# EAGLE design OpenAg_Signals_V6 (EAGLE 6.6.0)
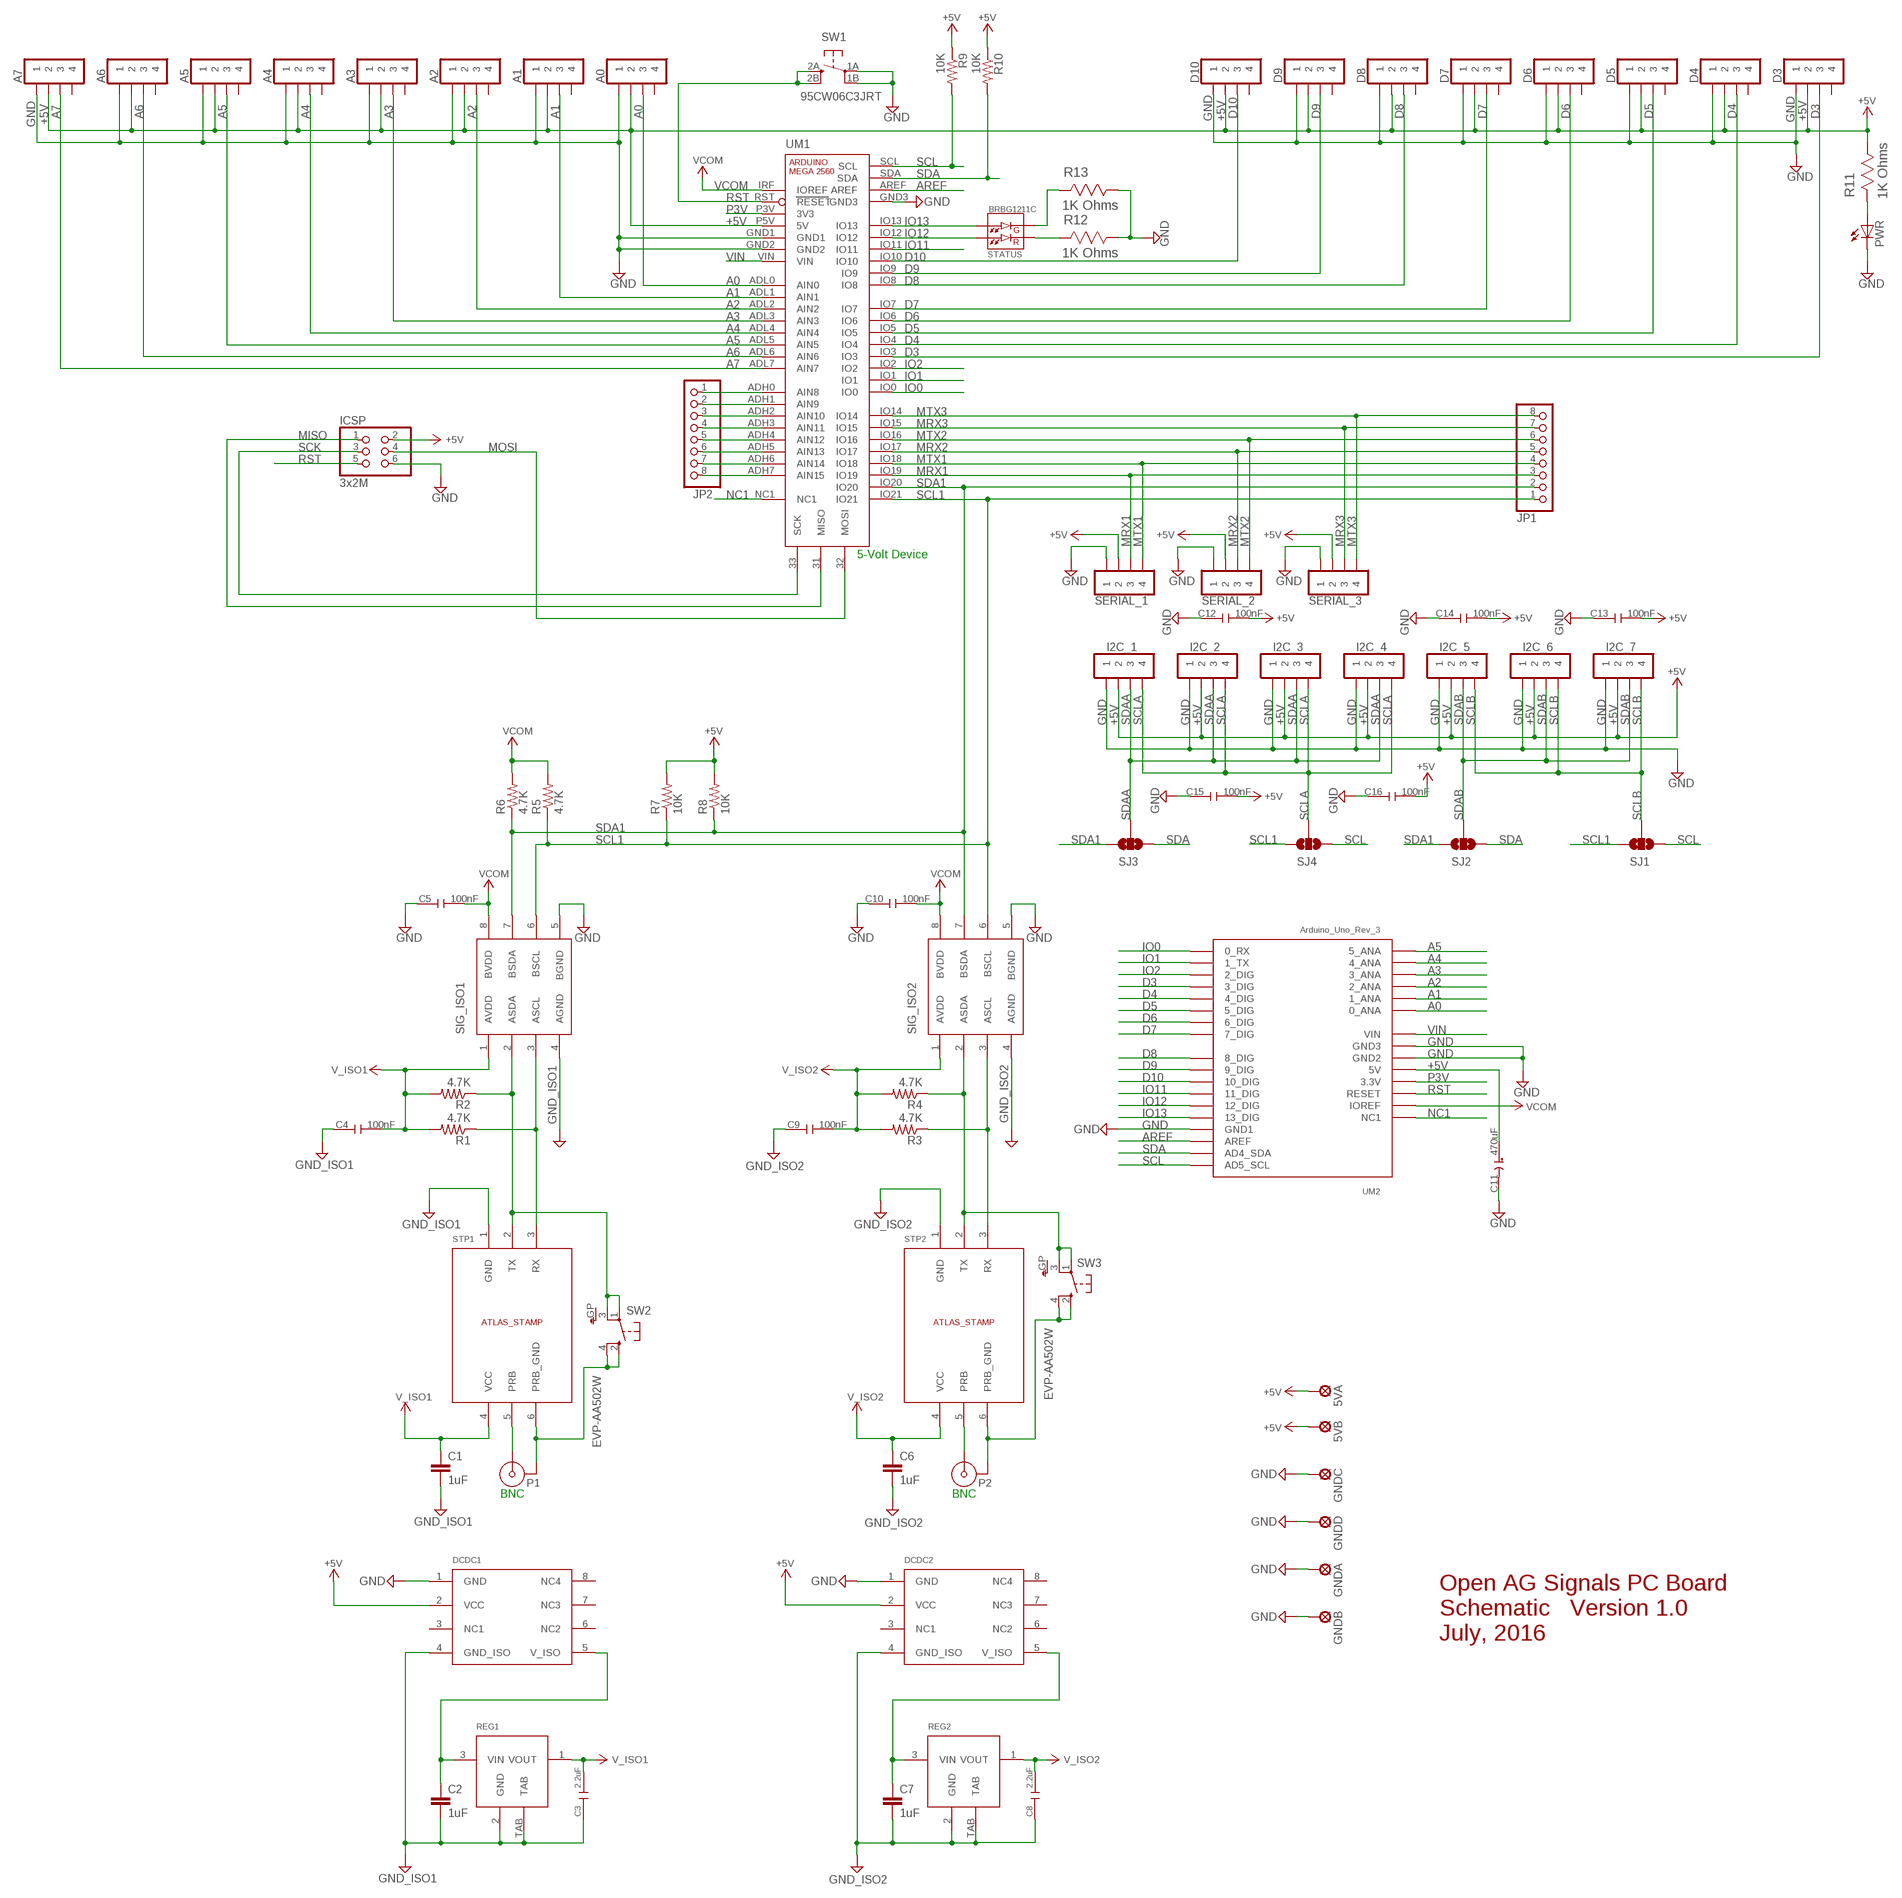
[diagram p0: schematic, sheet 1]

## Parts
5VA  PAD070  [PAD070]
5VB  PAD070  [PAD070]
A0  MOLEX_0705430003  [MOLEX_0705430003]
A1  MOLEX_0705430003  [MOLEX_0705430003]
A2  MOLEX_0705430003  [MOLEX_0705430003]
A3  MOLEX_0705430003  [MOLEX_0705430003]
A4  MOLEX_0705430003  [MOLEX_0705430003]
A5  MOLEX_0705430003  [MOLEX_0705430003]
A6  MOLEX_0705430003  [MOLEX_0705430003]
A7  MOLEX_0705430003  [MOLEX_0705430003]
C1  1uF  1UF-25V-10%(0805)  [0805]
C2  1uF  1UF-25V-10%(0805)  [0805]
C3  2.2uF  CGA4J1X7R1V225K125AC  [M0805]
C4  C-N-100.0N-X7R-25V-10P-0805  [M0805]
C5  C-N-100.0N-X7R-25V-10P-0805  [M0805]
C6  1uF  1UF-25V-10%(0805)  [0805]
C7  1uF  1UF-25V-10%(0805)  [0805]
C8  2.2uF  CGA4J1X7R1V225K125AC  [M0805]
C9  C-N-100.0N-X7R-25V-10P-0805  [M0805]
C10  C-N-100.0N-X7R-25V-10P-0805  [M0805]
C11  T495X477K010ATE100  [M2917]
C12  C-N-100.0N-X7R-25V-10P-0805  [M0805]
C13  C-N-100.0N-X7R-25V-10P-0805  [M0805]
C14  C-N-100.0N-X7R-25V-10P-0805  [M0805]
C15  C-N-100.0N-X7R-25V-10P-0805  [M0805]
C16  C-N-100.0N-X7R-25V-10P-0805  [M0805]
D3  MOLEX_0705430003  [MOLEX_0705430003]
D4  MOLEX_0705430003  [MOLEX_0705430003]
D5  MOLEX_0705430003  [MOLEX_0705430003]
D6  MOLEX_0705430003  [MOLEX_0705430003]
D7  MOLEX_0705430003  [MOLEX_0705430003]
D8  MOLEX_0705430003  [MOLEX_0705430003]
D9  MOLEX_0705430003  [MOLEX_0705430003]
D10  MOLEX_0705430003  [MOLEX_0705430003]
DCDC1  RECOM_R1SE_0505_R  [RECOM_R1SE_0505_R]
DCDC2  RECOM_R1SE_0505_R  [RECOM_R1SE_0505_R]
GNDA  PAD070  [PAD070]
GNDB  PAD070  [PAD070]
GNDC  PAD070  [PAD070]
GNDD  PAD070  [PAD070]
I2C_1  MOLEX_0705430003  [MOLEX_0705430003]
I2C_2  MOLEX_0705430003  [MOLEX_0705430003]
I2C_3  MOLEX_0705430003  [MOLEX_0705430003]
I2C_4  MOLEX_0705430003  [MOLEX_0705430003]
I2C_5  MOLEX_0705430003  [MOLEX_0705430003]
I2C_6  MOLEX_0705430003  [MOLEX_0705430003]
I2C_7  MOLEX_0705430003  [MOLEX_0705430003]
ICSP  3x2M  PINHD-2X3  [2X03]
JP1  PINHD-1X8BIG  [1X08-BIG]
JP2  PINHD-1X8BIG  [1X08-BIG]
P1  BNC_TE_1_1337542_0  [BNC_FEMALE_PANEL_RGT_ANGLE_MNT]
P2  BNC_TE_1_1337542_0  [BNC_FEMALE_PANEL_RGT_ANGLE_MNT]
PWR  LED_LEDCHIPLED_0805  [LED_CHIPLED_0805]
R1  4.7K  RESISTOR  [0805]
R2  4.7K  RESISTOR  [0805]
R3  4.7K  RESISTOR  [0805]
R4  4.7K  RESISTOR  [0805]
R5  4.7K  RESISTOR  [0805]
R6  4.7K  RESISTOR  [0805]
R7  10K  10KOHM1/10W1%(0603)0603  [0603-RES]
R8  10K  10KOHM1/10W1%(0603)0603  [0603-RES]
R9  10K  10KOHM1/10W1%(0603)0603  [0603-RES]
R10  10K  10KOHM1/10W1%(0603)0603  [0603-RES]
R11  1K Ohms  CPF0603F1K1C1  [RESC1608X60N]
R12  1K Ohms  CPF0603F1K1C1  [RESC1608X60N]
R13  1K Ohms  CPF0603F1K1C1  [RESC1608X60N]
REG1  LD2981ABU50TR  [SOT89]
REG2  LD2981ABU50TR  [SOT89]
SERIAL_1  MOLEX_0705430003  [MOLEX_0705430003]
SERIAL_2  MOLEX_0705430003  [MOLEX_0705430003]
SERIAL_3  MOLEX_0705430003  [MOLEX_0705430003]
SIG_ISO1  SI8600AC-B-IS  [SO8ISO]
SIG_ISO2  SI8600AC-B-IS  [SO8ISO]
SJ1  SOLDERJUMPER_2WAYT  [SJ_2]
SJ2  SOLDERJUMPER_2WAYT  [SJ_2]
SJ3  SOLDERJUMPER_2WAYT  [SJ_2]
SJ4  SOLDERJUMPER_2WAYT  [SJ_2]
STATUS  LED-REDGRN-BRBG1211C  [BILED-0605]
STP1  ATLAS_SCIENTIFIC_STAMP  [ATLAS_SCIENTIFIC_STAMP]
STP2  ATLAS_SCIENTIFIC_STAMP  [ATLAS_SCIENTIFIC_STAMP]
SW1  95CW06C3JRT  [GRAYHILL_95CW06C3JRT]
SW2  EVP-AA502W  [PANASONIC-EVP-AA502W]
SW3  EVP-AA502W  [PANASONIC-EVP-AA502W]
UM1  ARDUINO_MEGA_2560_R3_SIDES  [ARDUINO_MEGA_2560_R3_CONNECTORS]
UM2  ARDUINO_UNO_REV3_SOCKET  [ARDUINO_UNO_REV3_SOCKET]

## Nets
+5V: 5VA.1(MP) 5VB.1(MP) A0.2 A1.2 A2.2 A3.2 A4.2 A5.2 A6.2 A7.2 C11.P C12.2 C13.2 C14.2 C15.2 C16.2 D3.2 D4.2 D5.2 D6.2 D7.2 D8.2 D9.2 D10.2 DCDC1.2(VCC) DCDC2.2(VCC) I2C_1.2 I2C_2.2 I2C_3.2 I2C_4.2 I2C_5.2 I2C_6.2 I2C_7.2 ICSP.2 R7.2 R8.2 R9.1 R10.1 R11.1 SERIAL_1.2 SERIAL_2.2 SERIAL_3.2 UM1.P5V(5V) UM2.PWR_5V(5V)
A0: A0.3 UM1.ADL0(AIN0) UM2.AD0(0_ANA)
A1: A1.3 UM1.ADL1(AIN1) UM2.AD1(1_ANA)
A2: A2.3 UM1.ADL2(AIN2) UM2.AD2(2_ANA)
A3: A3.3 UM1.ADL3(AIN3) UM2.AD3(3_ANA)
A4: A4.3 UM1.ADL4(AIN4) UM2.AD4(4_ANA)
A5: A5.3 UM1.ADL5(AIN5) UM2.AD5(5_ANA)
A6: A6.3 UM1.ADL6(AIN6)
A7: A7.3 UM1.ADL7(AIN7)
AREF: UM1.AREF UM2.IOH15(AREF)
D3: D3.3 UM1.IO3 UM2.IOL3(3_DIG)
D4: D4.3 UM1.IO4 UM2.IOL4(4_DIG)
D5: D5.3 UM1.IO5 UM2.IOL5(5_DIG)
D6: D6.3 UM1.IO6 UM2.IOL6(6_DIG)
D7: D7.3 UM1.IO7 UM2.IOL7(7_DIG)
D8: D8.3 UM1.IO8 UM2.IOH8(8_DIG)
D9: D9.3 UM1.IO9 UM2.IOH9(9_DIG)
D10: D10.3 UM1.IO10 UM2.IOH10(10_DIG)
GND: A0.1 A1.1 A2.1 A3.1 A4.1 A5.1 A6.1 A7.1 C5.1 C10.1 C11.N C12.1 C13.1 C14.1 C15.1 C16.1 D3.1 D4.1 D5.1 D6.1 D7.1 D8.1 D9.1 D10.1 DCDC1.1(GND) DCDC2.1(GND) GNDA.1(MP) GNDB.1(MP) GNDC.1(MP) GNDD.1(MP) I2C_1.1 I2C_2.1 I2C_3.1 I2C_4.1 I2C_5.1 I2C_6.1 I2C_7.1 ICSP.6 PWR.C R12.1 R13.1 SERIAL_1.1 SERIAL_2.1 SERIAL_3.1 SIG_ISO1.5(BGND) SIG_ISO2.5(BGND) SW1.1A(PA1) SW1.1B(PA2) UM1.GND1 UM1.GND2 UM1.GND3 UM2.IOH14(GND1) UM2.PWR_GND2(GND2) UM2.PWR_GND3(GND3)
GND_ISO1: C1.2 C2.2 C3.1 C4.1 DCDC1.4(GND_ISO) REG1.2(GND) REG1.TAB SIG_ISO1.4(AGND) STP1.1(GND)
GND_ISO2: C6.2 C7.2 C8.1 C9.1 DCDC2.4(GND_ISO) REG2.2(GND) REG2.TAB SIG_ISO2.4(AGND) STP2.1(GND)
IO0: UM1.IO0 UM2.IOL0(0_RX)
IO1: UM1.IO1 UM2.IOL1(1_TX)
IO2: UM1.IO2 UM2.IOL2(2_DIG)
IO11: UM1.IO11 UM2.IOH11(11_DIG)
IO12: STATUS.1(RA) UM1.IO12 UM2.IOH12(12_DIG)
IO13: STATUS.3(GA) UM1.IO13 UM2.IOH13(13_DIG)
MISO: ICSP.1 UM1.31(MISO)
MOSI: ICSP.4 UM1.32(MOSI)
MRX1: JP1.3 SERIAL_1.3 UM1.IO19
MRX2: JP1.5 SERIAL_2.3 UM1.IO17
MRX3: JP1.7 SERIAL_3.3 UM1.IO15
MTX1: JP1.4 SERIAL_1.4 UM1.IO18
MTX2: JP1.6 SERIAL_2.4 UM1.IO16
MTX3: JP1.8 SERIAL_3.4 UM1.IO14
N$1: P1.1(P) STP1.5(PRB)
N$2: R12.2 STATUS.2(RC)
N$3: PWR.A R11.2
N$4: R1.1 SIG_ISO1.3(ASCL) STP1.3(RX)
N$5: R2.1 SIG_ISO1.2(ASDA) STP1.2(TX) SW2.1 SW2.3
N$6: P1.2(G1) STP1.6(PRB_GND) SW2.2 SW2.4
N$7: P2.1(P) STP2.5(PRB)
N$8: R13.2 STATUS.4(GC)
N$9: R3.1 SIG_ISO2.3(ASCL) STP2.3(RX)
N$10: P2.2(G1) STP2.6(PRB_GND) SW3.2 SW3.4
N$11: C2.1 DCDC1.5(V_ISO) REG1.3(VIN)
N$12: C7.1 DCDC2.5(V_ISO) REG2.3(VIN)
N$13: R4.1 SIG_ISO2.2(ASDA) STP2.2(TX) SW3.1 SW3.3
N$20: JP2.8 UM1.ADH7(AIN15)
N$21: JP2.7 UM1.ADH6(AIN14)
N$22: JP2.6 UM1.ADH5(AIN13)
N$23: JP2.5 UM1.ADH4(AIN12)
N$24: JP2.4 UM1.ADH3(AIN11)
N$25: JP2.3 UM1.ADH2(AIN10)
N$26: JP2.2 UM1.ADH1(AIN9)
N$27: JP2.1 UM1.ADH0(AIN8)
NC1: UM1.NC1 UM2.PWR_NC(NC1)
P3V: UM1.P3V(3V3) UM2.PWR_3_3V(3.3V)
RST: ICSP.5 SW1.2A(PB1) SW1.2B(PB2) UM1.RST(RESET) UM2.PWR_RESET(RESET)
SCK: ICSP.3 UM1.33(SCK)
SCL: R9.2 SJ1.1 SJ4.1 UM1.SCL UM2.IOH17(AD5_SCL)
SCL1: JP1.1 R5.1 R7.1 SIG_ISO1.6(BSCL) SIG_ISO2.6(BSCL) SJ1.3 SJ4.3 UM1.IO21
SCLA: I2C_1.4 I2C_2.4 I2C_3.4 I2C_4.4 SJ4.2
SCLB: I2C_5.4 I2C_6.4 I2C_7.4 SJ1.2
SDA: R10.2 SJ2.1 SJ3.1 UM1.SDA UM2.IOH16(AD4_SDA)
SDA1: JP1.2 R6.1 R8.1 SIG_ISO1.7(BSDA) SIG_ISO2.7(BSDA) SJ2.3 SJ3.3 UM1.IO20
SDAA: I2C_1.3 I2C_2.3 I2C_3.3 I2C_4.3 SJ3.2
SDAB: I2C_5.3 I2C_6.3 I2C_7.3 SJ2.2
V_ISO1: C1.1 C3.2 C4.2 R1.2 R2.2 REG1.1(VOUT) SIG_ISO1.1(AVDD) STP1.4(VCC)
V_ISO2: C6.1 C8.2 C9.2 R3.2 R4.2 REG2.1(VOUT) SIG_ISO2.1(AVDD) STP2.4(VCC)
VCOM: C5.2 C10.2 R5.2 R6.2 SIG_ISO1.8(BVDD) SIG_ISO2.8(BVDD) UM1.IRF(IOREF) UM2.PWR_IOREF(IOREF)
VIN: UM1.VIN UM2.PWR_VIN(VIN)
Unconnected: A0.4 A1.4 A2.4 A3.4 A4.4 A5.4 A6.4 A7.4 D3.4 D4.4 D5.4 D6.4 D7.4 D8.4 D9.4 D10.4 DCDC1.3(NC1) DCDC1.6(NC2) DCDC1.7(NC3) DCDC1.8(NC4) DCDC2.3(NC1) DCDC2.6(NC2) DCDC2.7(NC3) DCDC2.8(NC4) SW2.GP(GPIN) SW3.GP(GPIN)

## Notes on the sheet
- 5-Volt Device
- BNC | BNC
- Open AG Signals PC Board
  Schematic   Version 1.0
  July, 2016

## Library data of the parts
5VA 5VB GNDA GNDB GNDC GNDD = REM_Connectors_Generic:PAD070
A0 A1-A7 D3-D10 I2C_1-I2C_7 SERIAL_1-SERIAL_3 = REM_Connectors_Molex:MOLEX_0705430003: Male Header, 4 positions, shrouded with latch slot, 100-mil pitch, through-hole mounted, gold plated pins
C1 C2 C6 C7 = SparkFun-Capacitors:1UF-25V-10%(0805): CAP-08064; PROD_ID: CAP-08064
C3 C8 = REM_Capacitors_SurfaceMount_TDK:CGA4J1X7R1V225K125AC: 2.2µF 35V Ceramic Capacitor X7R 0805 (2012 Metric) 0.079" L x 0.049" W (2.00mm x 1.25mm)
C4 C5 C9 C10 C12-C16 = aggregate-parts:C-*-?; VAL: 100nF
C11 = REM_Capacitors_SurfaceMount_AVX:T495X477K010ATE100: 470µF Molded Tantalum Capacitor 10V 2917 (7343 Metric) 100 mOhm 0.287" L x 0.169" W (7.30mm x 4.30mm); VAL: 470uF
DCDC1 DCDC2 = REM_DC_to_DC_Converters_Recom:RECOM_R1SE_0505_R: DC/DC CONVERTER, 1W, 5VIN, 5VOUT
ICSP = SmartPrj:PINHD-2X3: PIN HEADER
JP1 JP2 = adafruitNew:PINHD-1X8: PIN HEADER
P1 P2 = REM_Connectors_Tyco:BNC_TE_1_1337542_0: BNC Connector Jack, Female Socket 50 Ohm Panel Mount, Bulkhead; Through Hole, Right Angle Solder
PWR = arduino_Uno_Rev3-02-TH:LED_LED: LED OSRAM: - CHIPLED LG R971, LG N971, LY N971, LG Q971, LY Q971, LO R971, LY R971 LH N974, LH R974 LS Q976, LO Q976, LY Q976 LO Q996 - Hyper CHIPLED LW Q18S LB Q993, LB Q99A, LB R99A - SideLED LS A670, LO A670, LY A670, LG A670, LP A670 LB A673, LV A673, LT A673, LW A673 LH A674 LY A675 LS A676, LA A676, LO A676, LY A676, LW A676 LS A679, LY A679, LG A679 - Hyper Micro SIDELED® LS Y876, LA Y876, LO Y876, LY Y876 LT Y87S - SmartLED LW L88C, LW L88S LB L89C, LB L89S, LG L890 LS L89K, LO L89K, LY L89K LS L896, LA L896, LO L896, LY L896 - TOPLED LS T670, LO T670, LY T670, LG T670, LP T670 LSG T670, LSP T670, LSY T670, LOP T670, LYG T670 LG T671, LOG T671, LSG T671 LB T673, LV T673, LT T673, LW T673 LH T674 LS T676, LA T676, LO T676, LY T676, LB T676, LH T676, LSB T676, LW T676 LB T67C, LV T67C, LT T67C, LS T67K, LO T67K, LY T67K, LW E67C LS E67B, LA E67B, LO E67B, LY E67B, LB E67C, LV E67C, LT E67C LW T67C LS T679, LY T679, LG T679 LS T770, LO T770, LY T770, LG T770, LP T770 LB T773, LV T773, LT T773, LW T773 LH T774 LS E675, LA E675, LY E675, LS T675 LS T776, LA T776, LO T776, LY T776, LB T776 LHGB T686 LT T68C, LB T68C - Hyper Mini TOPLED® LB M676 - Mini TOPLED Santana® LG M470 LS M47K, LO M47K, LY M47K Source: http://www.osram.convergy.de LUXEON: - LUMILED® LXK2-PW12-R00, LXK2-PW12-S00, LXK2-PW14-U00, LXK2-PW14-V00 LXK2-PM12-R00, LXK2-PM12-S00, LXK2-PM14-U00 LXK2-PE12-Q00, LXK2-PE12-R00, LXK2-PE12-S00, LXK2-PE14-T00, LXK2-PE14-U00 LXK2-PB12-K00, LXK2-PB12-L00, LXK2-PB12-M00, LXK2-PB14-N00, LXK2-PB14-P00, LXK2-PB14-Q00 LXK2-PR12-L00, LXK2-PR12-M00, LXK2-PR14-Q00, LXK2-PR14-R00 LXK2-PD12-Q00, LXK2-PD12-R00, LXK2-PD12-S00 LXK2-PH12-R00, LXK2-PH12-S00 LXK2-PL12-P00, LXK2-PL12-Q00, LXK2-PL12-R00 Source: www.luxeon.com KINGBRIGHT: KA-3528ASYC Source: www.kingbright.com
R1-R6 = SparkFun:RESISTOR: Resistor Basic schematic elements and footprints for 0603, 1206, and PTH 1/10th watt (small) resistors.
R7-R10 = SparkFun-Resistors:10KOHM1/10W1%(0603): RES-00824; PROD_ID: RES-00824
R11-R13 = Tyco_By_element14_Batch_1:CPF0603F1K1C1: Resistor, 0603, 1K1; MPN: CPF0603F1K1C1; OC_FARNELL: 1527476; OC_NEWARK: 51R8603; SUPPLIER: Tyco; TOLERANCE: ± 1%; WATTAGE: 0.063W
REG1 REG2 = REM_VoltageRegulators_ST_Microelectronics:LD2981ABU50TR: Linear Voltage Regulator, Positive, Fixed, 5V @100mA, SOT-89-3
SIG_ISO1 SIG_ISO2 = REM_DigitalIsolators_SiliconLabs:SI8600AC-B-IS: I2C Digital Isolator, 3750Vrms, 2 Channels, 35kV/µs, CMTI 8-SOIC (0.154", 3.90mm Width)
SJ1-SJ4 = SparkFun:SOLDERJUMPER_2WAY: Solder Jumper 2 way solder jumper
STATUS = REM_LEDs_StanleyElectric:LED-REDGRN-BRBG1211C: Green-Red LED, 0605 (corrected symbol for R00816); RNUMBER: R00816; VAL: BRBG1211C
STP1 STP2 = REM_AtlasScientific:ATLAS_SCIENTIFIC_STAMP: Atlas Scientific Stamp Module, footprint
SW1 = REM_Switches_Grayhill:95CW06C3JRT: Tactile Switch SPST-NO Top Actuated Surface Mount
SW2 SW3 = REM_TactSwitches_Panasonic:EVP-AA502W: Tact Switch, Momentary, Normally-Open, SPST, with ground pin, 20mA @15 Volts; VAL: EVP-AA502W
UM1 = REM_ArduinoMega:ARDUINO_MEGA_2560_R3_SIDES: Arduino Mega 2560 Rev. 3, side connection headers pattern
UM2 = REM_Arduino:ARDUINO_UNO_REV3_SOCKET: Arduino Uno Rev 3 I/O Connectors Footprint; VAL: Arduino_Uno_Rev_3

## Board
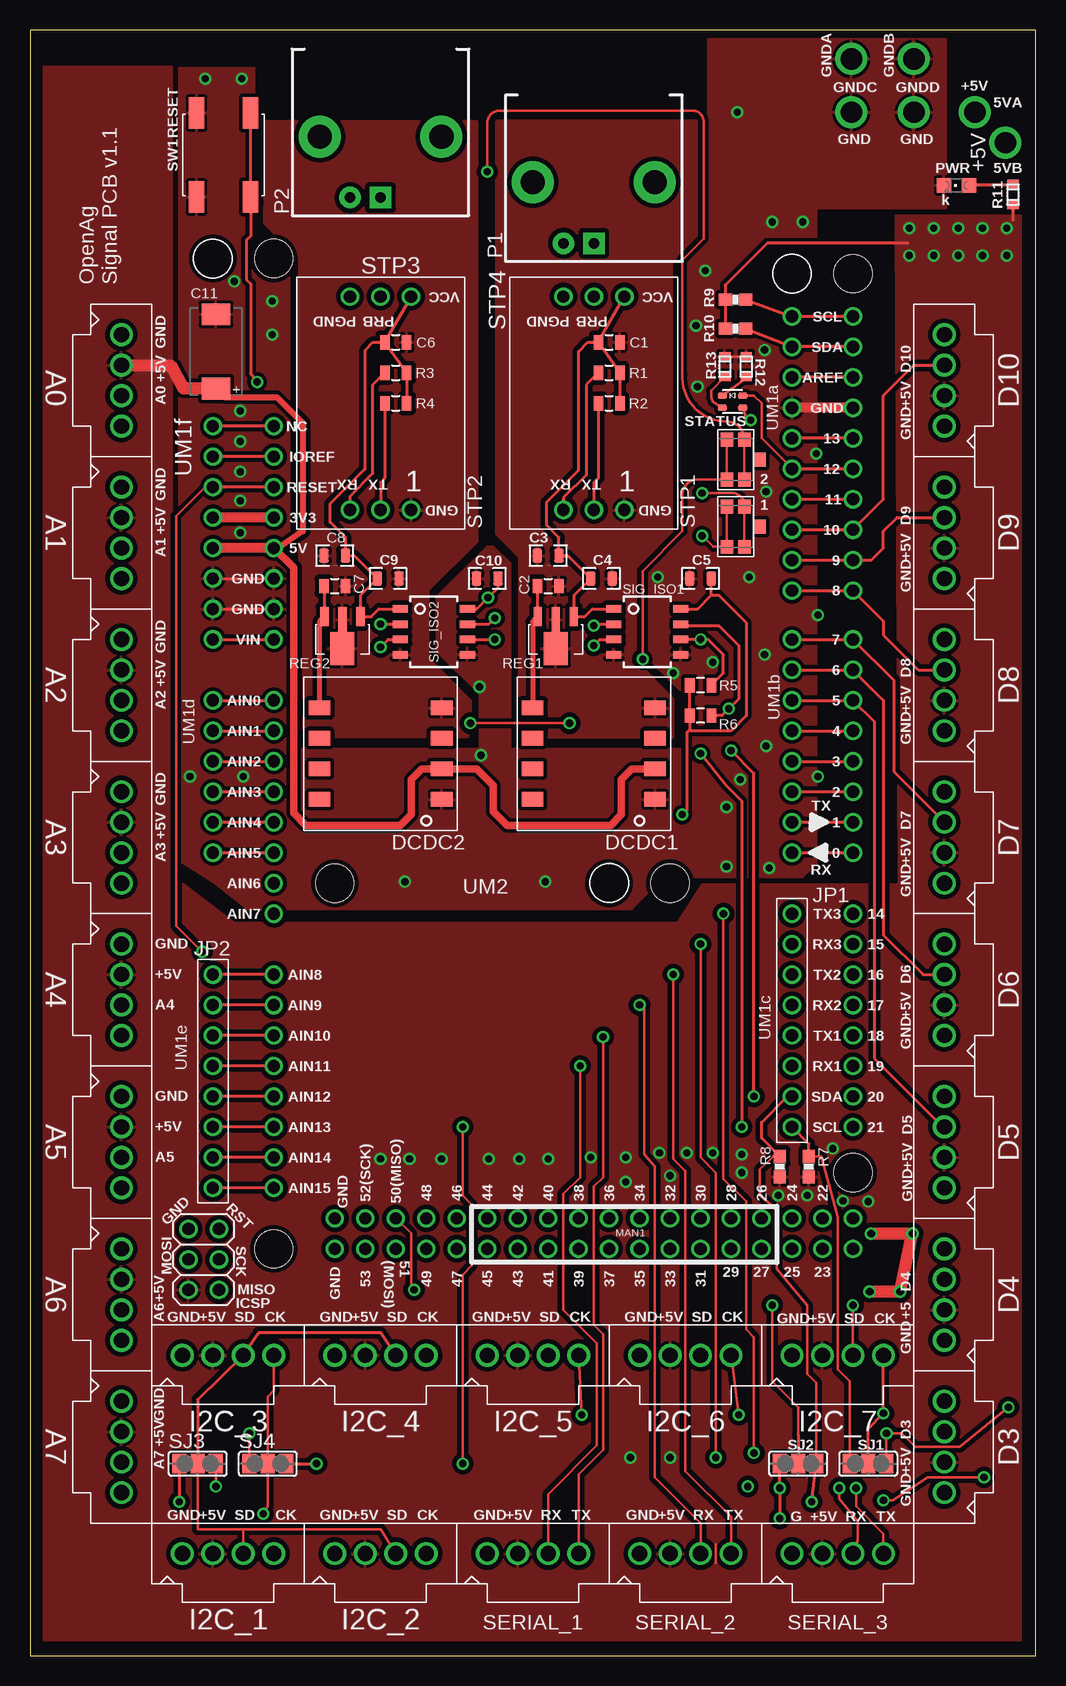
[diagram p1: board, top side]
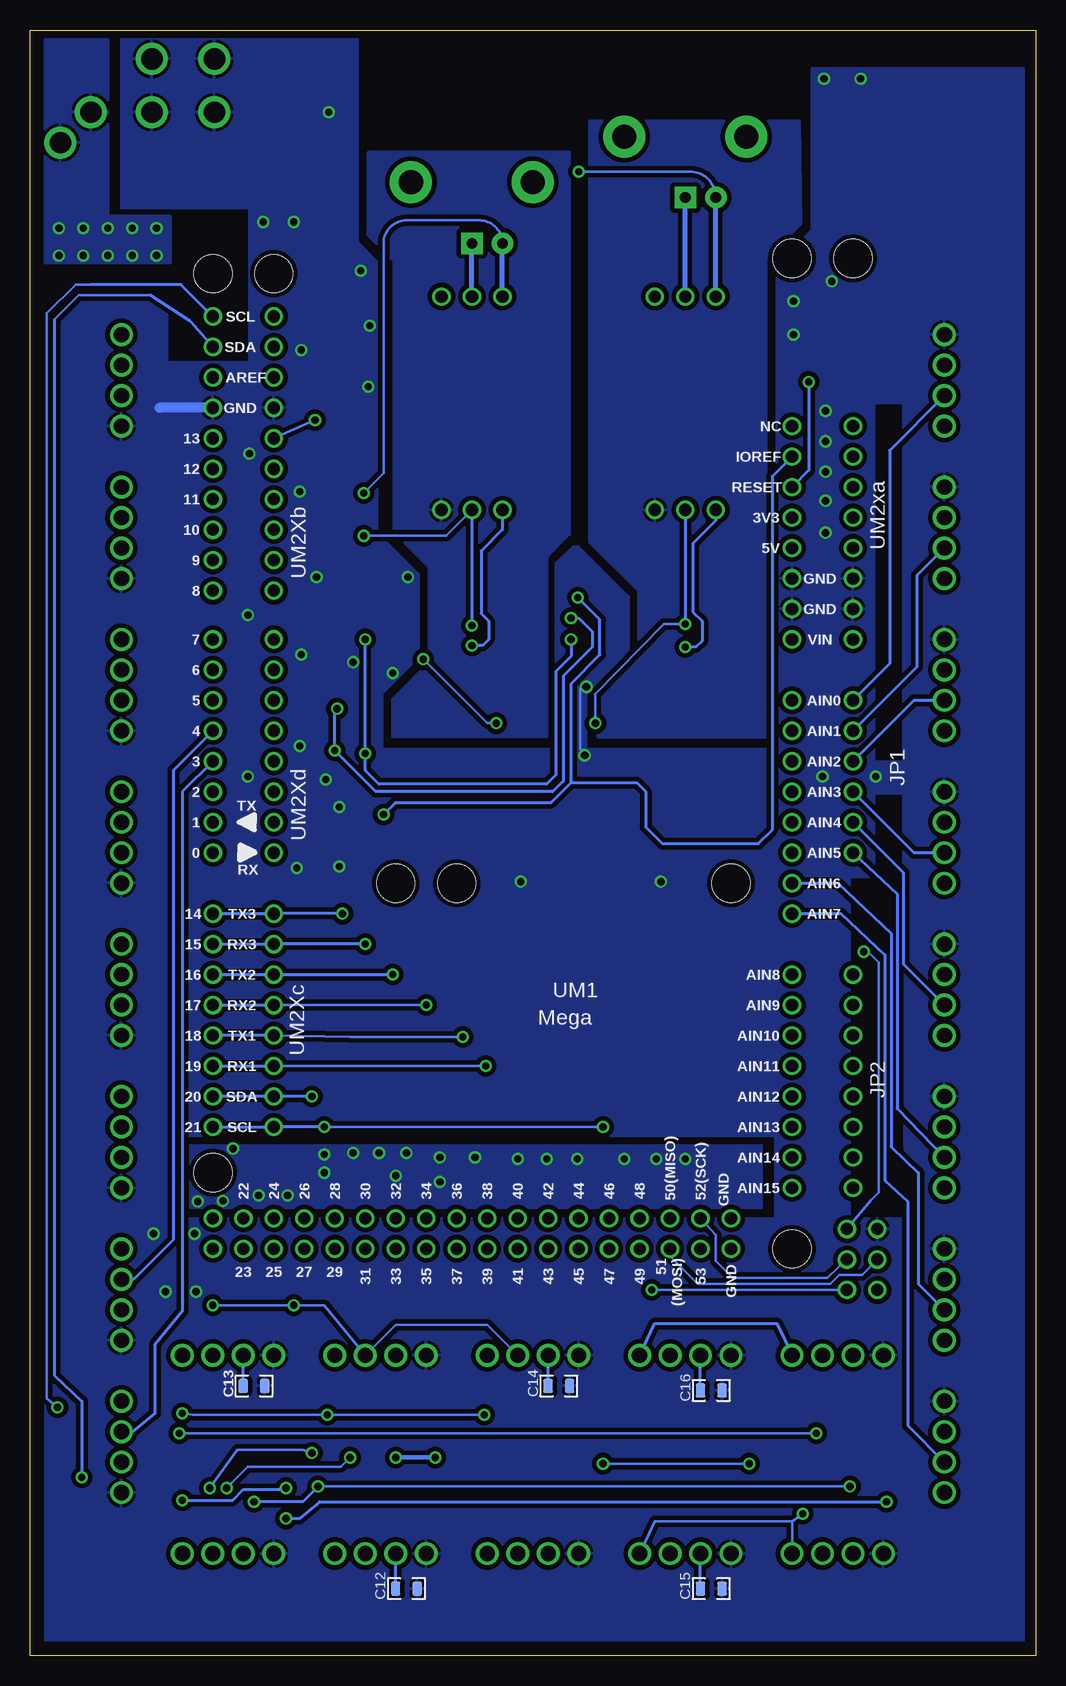
[diagram p2: board, bottom side, seen from below]

Size 83.82 x 135.51 mm. Coordinates in mm from the lower left corner, seen from the top.
Outline: 83.82,0 83.82,135.51 0,135.51 0,0 83.82,0
Copper layers (1*16): Top 0.035mm / dielectric 1.5mm / Bottom 0.035mm
Design rules "FuzeIlluminatorDesignRules": minimum track width 6mil, minimum drill 15mil, track to track 6mil, track to pad 6mil, pad to pad 6mil, via to via 6mil, smd to smd 6mil, copper to edge 15mil, drill to drill 8mil, minimum pad ring 10mil, minimum via ring 8mil, stop-mask expansion 4mil, vias tented up to drill 0mil, thermal gap 10mil

### Footprints (pad centres in the part's own frame; a part is rotated, then mirrored left to right if it is on the bottom)
PAD070 = drill 1.778 pad 2.667: 1 0,0
MOLEX_0705430003 = drill 1.27 pad 1.778: 1 3.81,0; 2 1.27,0; 3 -1.27,0; 4 -3.81,0
0805 = smd 0.8 x 1.2: 1 -0.9,0; 2 0.9,0
M0805 = smd 0.8 x 1.15: 1 -0.9,0; 2 0.9,0
M2917 = smd 1.8 x 2.4: N 3.1,0; P -3.1,0
RECOM_R1SE_0505_R = smd 1.2 x 1.8: 1 -3.81,-5.1; 2 -1.27,-5.1; 3 1.27,-5.1; 4 3.81,-5.1; 5 3.81,5.1; 6 1.27,5.1; 7 -1.27,5.1; 8 -3.81,5.1
2X03 = drill 1.016 pad 1.422: 1 -2.54,-1.27; 2 -2.54,1.27; 3 0,-1.27; 4 0,1.27; 5 2.54,-1.27; 6 2.54,1.27
1X08-BIG = drill 1.016 pad 1.422: 1 -8.89,0; 2 -6.35,0; 3 -3.81,0; 4 -1.27,0; 5 1.27,0; 6 3.81,0; 7 6.35,0; 8 8.89,0
BNC_FEMALE_PANEL_RGT_ANGLE_MNT = drill 0.89 pad 1.8 square: 1 0,-5.08 | drill 0.89 pad 1.8: 2 -2.54,-5.08 | drill 2.01 pad 3.5: M1 -5.08,0; M2 5.08,0
LED_CHIPLED_0805 = smd 1.2 x 1.2: A 0,-1.05; C 0,1.05
0603-RES = smd 1.1 x 1: 1 -0.85,0; 2 0.85,0
RESC1608X60N = smd 0.762 x 0.94: 1 -0.838,0; 2 0.838,0
SOT89 = smd 0.701 x 1.6: 1 -1.501,-1.9; 3 1.501,-1.9 | smd 0.701 x 2.101: 2 0,-1.651 | smd 1.999 x 2.751: TAB 0,0.749
SO8ISO = smd 0.635 x 1.27: 1 -1.905,-2.794; 2 -0.635,-2.794; 3 0.635,-2.794; 4 1.905,-2.794; 5 1.905,2.794; 6 0.635,2.794; 7 -0.635,2.794; 8 -1.905,2.794
SJ_2 = smd 1.168 x 1.6: 1 -1.524,0; 2 0,0; 3 1.524,0
BILED-0605 = smd 0.5 x 0.8: 1 -0.5,0.85; 2 -0.5,-0.85; 3 0.5,0.85; 4 0.5,-0.85
ATLAS_SCIENTIFIC_STAMP = drill 1.016: 1 -2.54,8.89; 2 0,8.89; 3 2.54,8.89; 4 -2.54,-8.89; 5 0,-8.89; 6 2.54,-8.89
GRAYHILL_95CW06C3JRT = smd 2.6 x 1.3: 1A -3.5,-2.25; 1B 3.5,-2.25; 2A -3.5,2.25; 2B 3.5,2.25
PANASONIC-EVP-AA502W = smd 1.15 x 1.05: 1 -1.675,0.725; 2 -1.675,-0.725; 3 1.675,0.725; 4 1.675,-0.725; GP 0,-2
ARDUINO_MEGA_2560_R3_CONNECTORS = drill 1.016 pad 1.422: 1 93.98,50.8; 2 96.52,50.8; 3 93.98,48.26; 4 96.52,48.26; 5 93.98,45.72; 6 96.52,45.72; 7 93.98,43.18; 8 96.52,43.18; 9 93.98,40.64; 10 96.52,40.64; 11 93.98,38.1; 12 96.52,38.1; 13 93.98,35.56; 14 96.52,35.56; 15 93.98,33.02; 16 96.52,33.02; 17 93.98,30.48; 18 96.52,30.48; 19 93.98,27.94; 20 96.52,27.94; 21 93.98,25.4; 22 96.52,25.4; 23 93.98,22.86; 24 96.52,22.86; 25 93.98,20.32; 26 96.52,20.32; 27 93.98,17.78; 28 96.52,17.78; 29 93.98,15.24; 30 96.52,15.24; 31 93.98,12.7; 32 96.52,12.7; 33 93.98,10.16; 34 96.52,10.16; 35 93.98,7.62; 36 96.52,7.62; ADH0 73.66,2.54; ADH1 76.2,2.54; ADH2 78.74,2.54; ADH3 81.28,2.54; ADH4 83.82,2.54; ADH5 86.36,2.54; ADH6 88.9,2.54; ADH7 91.44,2.54; ADL0 50.8,2.54; ADL1 53.34,2.54; ADL2 55.88,2.54; ADL3 58.42,2.54; ADL4 60.96,2.54; ADL5 63.5,2.54; ADL6 66.04,2.54; ADL7 68.58,2.54; AREF 23.876,50.8; GND1 40.64,2.54; GND2 43.18,2.54; GND3 26.416,50.8; IO0 63.5,50.8; IO1 60.96,50.8; IO2 58.42,50.8; IO3 55.88,50.8; IO4 53.34,50.8; IO5 50.8,50.8; IO6 48.26,50.8; IO7 45.72,50.8; IO8 41.656,50.8; IO9 39.116,50.8; IO10 36.576,50.8; IO11 34.036,50.8; IO12 31.496,50.8; IO13 28.956,50.8; IO14 68.58,50.8; IO15 71.12,50.8; IO16 73.66,50.8; IO17 76.2,50.8; IO18 78.74,50.8; IO19 81.28,50.8; IO20 83.82,50.8; IO21 86.36,50.8; IRF 30.48,2.54; NC1 27.94,2.54; P3V 35.56,2.54; P5V 38.1,2.54; RST 33.02,2.54; SCL 18.796,50.8; SDA 21.336,50.8; VIN 45.72,2.54 | hole 3.175: 13.97,2.54; 66.04,7.62; 66.04,35.56; 90.17,50.8; 15.24,50.8; 96.52,2.54
ARDUINO_UNO_REV3_SOCKET = drill 1.016 pad 1.422: AD0 50.8,2.54; AD1 53.34,2.54; AD2 55.88,2.54; AD3 58.42,2.54; AD4 60.96,2.54; AD5 63.5,2.54; IOH8 41.656,50.8; IOH9 39.116,50.8; IOH10 36.576,50.8; IOH11 34.036,50.8; IOH12 31.496,50.8; IOH13 28.956,50.8; IOH14 26.416,50.8; IOH15 23.876,50.8; IOH16 21.336,50.8; IOH17 18.796,50.8; IOL0 63.5,50.8; IOL1 60.96,50.8; IOL2 58.42,50.8; IOL3 55.88,50.8; IOL4 53.34,50.8; IOL5 50.8,50.8; IOL6 48.26,50.8; IOL7 45.72,50.8; PWR_3_3V 35.56,2.54; PWR_5V 38.1,2.54; PWR_GND2 40.64,2.54; PWR_GND3 43.18,2.54; PWR_IOREF 30.48,2.54; PWR_NC 27.94,2.54; PWR_RESET 33.02,2.54; PWR_VIN 45.72,2.54 | hole 3.175: 15.24,50.8; 13.97,2.54; 66.04,35.56

### Placement (x,y rotation side)
5VA  78.74,128.65 0 top
5VB  81.28,126.11 0 top
A0  7.62,106.3 90 top
A1  7.62,93.6 90 top
A2  7.62,80.9 90 top
A3  7.62,68.2 90 top
A4  7.62,55.5 90 top
A5  7.62,42.8 90 top
A6  7.62,30.1 90 top
A7  7.62,17.4 90 top
C1  48.26,109.47 0 top
C2  43.18,89.15 0 top
C3  43.18,91.69 0 top
C4  47.62,89.79 180 top
C5  55.88,89.79 0 top
C6  30.48,109.47 0 top
C7  25.4,89.15 0 top
C8  25.4,91.69 0 top
C9  29.84,89.79 180 top
C10  38.1,89.79 0 top
C11  15.49,108.71 90 top
C12  52.45,5.59 180 bottom
C13  65.15,22.48 180 bottom
C14  39.75,22.48 180 bottom
C15  27.05,5.59 180 bottom
C16  27.05,22.1 180 bottom
D3  76.2,17.4 270 top
D4  76.2,30.1 270 top
D5  76.2,42.8 270 top
D6  76.2,55.5 270 top
D7  76.2,68.2 270 top
D8  76.2,80.9 270 top
D9  76.2,93.6 270 top
D10  76.2,106.3 270 top
DCDC1  46.99,75.18 90 top
DCDC2  29.21,75.18 90 top
GNDA  68.45,133.1 0 top
GNDB  73.66,133.1 0 top
GNDC  68.45,128.65 0 top
GNDD  73.66,128.65 0 top
I2C_1  16.51,8.51 180 top
I2C_2  29.21,8.51 180 top
I2C_3  16.51,25.02 180 top
I2C_4  29.21,25.02 180 top
I2C_5  41.91,25.02 180 top
I2C_6  54.61,25.02 180 top
I2C_7  67.31,25.02 180 top
ICSP  14.48,33.02 90 top
JP1  63.5,52.96 90 top
JP2  15.24,47.88 270 top
P1  46.99,122.81 0 top
P2  29.21,126.62 0 top
PWR  77.22,122.55 90 top
R1  48.26,106.93 0 top
R2  48.26,104.39 0 top
R3  30.48,106.93 0 top
R4  30.48,104.39 0 top
R5  55.88,80.9 180 top
R6  55.88,78.36 180 top
R7  64.9,40.77 270 top
R8  62.48,40.77 270 top
R9  58.8,113.03 0 top
R10  58.8,110.62 0 top
R11  81.92,121.79 90 top
R12  59.69,107.44 270 top
R13  57.91,107.44 270 top
REG1  43.81,84.71 180 top
REG2  26.04,84.71 180 top
SERIAL_1  41.91,8.51 180 top
SERIAL_2  54.61,8.51 180 top
SERIAL_3  67.31,8.51 180 top
SIG_ISO1  51.44,85.34 270 top
SIG_ISO2  33.66,85.34 270 top
SJ1  69.85,16 180 top
SJ2  64.01,16 0 top
SJ3  13.97,16 0 top
SJ4  19.81,16 0 top
STATUS  58.55,104.52 270 top
STP1  46.99,104.39 180 top
STP2  29.21,104.39 180 top
SW1  16.13,125.09 270 top
SW2  58.8,94.11 90 top
SW3  58.8,99.69 90 top
UM1  17.78,130.43 270 top
UM2  12.7,130.43 270 top

### Tracks (layer width: path | path; a pad name or v marks a point on that pad's centre or on a via)
+5V  (via drill 0.6)
  Top 0.203: 57.15,9.27 57.15,7.75 | 20.7,92.33 UM1.P5V | 15.49,105.66 C11.P
  Top 0.254: R10.1 R9.1 57.94,113.04 57.94,114.25 61.42,117.73 73.15,117.73 | R11.1 81.92,119.63
  Top 0.508: 15.49,105.66 16.26,104.9 20.57,104.9 22.73,102.74 22.73,93.73 20.7,92.33
  Top 0.61: DCDC1.2 50.16,73.91 49.28,73.02 49.28,70.1 48.39,69.22 39.75,69.22 38.61,70.36 38.61,72.52 37.21,73.91 DCDC2.2 32.64,73.91 31.75,73.02 31.75,70.1 30.86,69.22 22.99,69.22 21.97,70.23 21.97,90.68 UM1.P5V
  Top 0.813: UM1.P5V UM2.PWR_5V
  Top 1.016: A0.2 11.71,107.57 12.78,105.64 15.21,105.64 C11.P
  Bottom 0.254: C12.2 53.35,8.5 SERIAL_2.2 | C13.2 66.05,25.01 I2C_7.2 | 15.25,8.5 I2C_1.2 | C14.2 40.65,25.01 I2C_5.2 | C15.2 27.95,8.5 I2C_2.2 | C16.2 27.95,25.01 I2C_4.2
  Bottom 0.381: v50.04,16.51 v53.34,16.51
  other vias: 59.31,40.26 64.77,38.35 69.85,37.85 52.45,41.91 53.34,40.01 46.74,41.53 43.18,41.4 49.66,39.5 49.66,41.53 62.36,38.35 67.74,37.9 59.31,41.78 40.77,41.4 38.23,41.4 34.29,41.4 31.62,41.4 29.21,41.4 73.28,119 75.31,119 75.31,116.71 73.28,116.71 77.34,119 79.38,119 79.38,116.71 77.34,116.71 81.41,116.71 81.41,119 56.9,41.91 66.9,42.27 54.74,41.91
  pour Top (isolate 0.381): 72.14,120.02 72.39,64.26 56.01,64.26 53.98,61.09 17.02,61.09 11.81,65.02 11.81,132.46 1.14,132.46 1.14,1.27 82.55,1.27 82.55,120.02
  pour Bottom (isolate 0.381): 22.86,42.55 70.48,42.55 70.48,37.34 22.86,37.34
  pour Bottom: 72.14,116.08 82.55,116.08 82.55,134.75 77.34,134.75 77.34,120.02 72.14,120.02
A0
  Top 0.254: UM2.AD0 UM1.ADL0
  Bottom 0.254: A0.3 12.19,100.46 12.19,82.68 UM2.AD0
A1
  Top 0.254: UM2.AD1 UM1.ADL1
  Bottom 0.254: A1.3 9.91,90.04 9.91,82.42 UM2.AD1
A2
  Top 0.254: UM2.AD2 UM1.ADL2
  Bottom 0.254: A2.3 10.16,79.63 UM2.AD2
A3
  Top 0.254: UM2.AD3 UM1.ADL3
  Bottom 0.254: UM2.AD3 10.16,66.93 A3.3
A4
  Top 0.254: UM2.AD4 UM1.ADL4
  Bottom 0.254: UM2.AD4 11.05,65.28 11.05,57.66 A4.3
A5
  Top 0.254: UM2.AD5 UM1.ADL5
  Bottom 0.254: UM2.AD5 11.56,63.5 11.56,45.59 A5.3
A6
  Bottom 0.254: UM1.ADL6 16.51,64.39 12.06,60.2 12.06,42.42 9.78,40.26 9.78,30.99 A6.3
A7
  Bottom 0.254: UM1.ADL7 16.26,61.85 12.57,58.42 12.57,39.62 10.67,37.85 10.67,19.18 A7.3
AREF
  Top 0.254: UM1.AREF UM2.IOH15
D3
  Top 0.254: UM2.IOL3 UM1.IO3
  Bottom 0.254: UM1.IO3 71.12,72.01 71.12,28.7 73.41,25.91 73.41,20.19 75.31,18.67 D3.3
D4
  Top 0.254: UM2.IOL4 UM1.IO4
  Bottom 0.254: UM1.IO4 71.88,73.79 71.88,34.67 75.18,31.37 D4.3
D5
  Top 0.254: UM2.IOL5 UM1.IO5 70.36,77.85 70.36,49.78 76.07,44.07 D5.3
D6
  Top 0.254: UM2.IOL6 UM1.IO6 71.12,79.63 71.12,60.07 74.42,56.77 D6.3
D7
  Top 0.254: UM2.IOL7 UM1.IO7 72.01,81.28 72.01,73.66 D7.3
D8
  Top 0.254: UM2.IOH8 UM1.IO8 71.12,86.23 71.12,85.09 74.04,82.17 D8.3
D9
  Top 0.254: UM2.IOH9 UM1.IO9 70.1,91.31 71.12,92.33 71.12,93.73 72.26,94.87 D9.3
D10
  Top 0.254: UM2.IOH10 UM1.IO10 71.12,96.39 71.12,105.03 73.66,107.57 D10.3
GND  (via drill 0.6, 0.64 pad 1.02)
  Top 0.203: R13.1 R12.1
  Top 0.254: UM2.PWR_GND3 UM1.GND2 | UM2.PWR_GND2 UM1.GND1
  Top 0.813: UM1.GND3 UM2.IOH14
  Top 1.016: v70.1,35.18 v73.53,35.18 v72.52,30.35 v69.98,30.35
  Bottom 0.203: 37.97,80.64 37.97,75.56
  Bottom 0.813: UM1.GND3 73.03,104.01
  other vias: 61.85,119.51 64.39,119.51 61.21,108.84 17.02,114.55 17.53,103.76 13.34,73.28 20.19,110.11 20.19,112.9 37.47,80.77 37.59,75.06 55.63,105.79 56.26,115.44 58.93,128.65 56.9,82.8 52.32,89.92 53.59,81.91 59.18,73.02 59.94,89.92 61.59,65.66 61.34,75.82 61.21,83.44 58.04,65.79 58.04,70.74 61.34,97.03 31.24,64.52 42.93,64.52 17.65,131.44 14.61,131.44 55.5,110.87 65.53,100.2 65.66,86.74 65.66,73.28 17.53,98.68 17.53,96.27 17.53,93.6 17.53,101.22 17.78,73.28
  pour Bottom (isolate 0.381): 72.39,115.44 72.26,36.45 10.92,36.45 11.05,71.88 14.35,71.88 14.35,74.55 11.05,74.55 11.05,104.39 14.61,104.39 14.61,132.33 1.02,132.33 1.02,1.27 82.55,1.27 82.55,115.44
  pour Top (isolate 0.305): 12.45,132.33 12.45,66.29 15.24,64.52 18.16,62.23 50.16,62.23 52.83,64.9 64.39,64.9 65.53,66.04 65.53,120.65 76.33,120.65 76.33,134.75 56.52,134.75 56.52,117.86 54.86,116.2 54.86,93.6 51.44,90.17 51.44,83.18 54.48,80.14 54.48,75.56 40.01,75.56 40.01,91.06 38.61,92.46 38.1,92.46 33.91,88.27 33.91,83.69 37.47,80.14 37.47,75.56 21.46,75.56 21.59,82.04 21.59,116.08 19.94,117.6 18.67,118.87 18.67,132.33
  pour Bottom (isolate 0.381): 13.46,132.33 13.46,64.9 15.49,64.9 15.49,36.07 21.72,36.07 21.72,43.31 70.61,43.31 70.61,65.02 73.53,65.02 73.53,107.82 65.53,107.82 65.53,120.65 76.2,120.65 76.2,134.75 56.52,134.75 56.52,117.86 54.86,116.2 54.86,93.6 51.44,90.17 51.44,83.18 54.48,80.14 54.48,75.56 40.01,75.56 40.01,91.06 38.61,92.46 38.1,92.46 33.91,88.27 33.91,83.69 37.47,80.14 37.47,75.56 21.46,75.56 21.59,82.04 21.59,116.08 19.94,117.6 18.67,118.87 18.67,132.33
GND_ISO1
  pour Top (isolate 0.381): 38.86,127.89 38.86,93.47 40.77,91.57 40.77,76.58 53.59,76.58 53.59,79.76 50.55,82.8 50.55,90.68 53.47,93.6 53.47,116.2 55.63,118.36 55.63,127.89
  pour Bottom (isolate 0.381): 38.86,125.35 38.86,93.47 40.77,91.57 40.77,76.58 53.59,76.58 53.59,79.76 50.55,82.8 50.55,90.68 53.47,93.6 53.47,116.2 55.63,118.36 55.63,125.35
GND_ISO2
  pour Top (isolate 0.381): 19.68,127.89 37.21,127.89 37.21,92.84 33.15,88.77 33.15,83.18 36.7,79.63 36.7,76.83 36.45,76.58 22.48,76.58 22.48,116.46 19.56,119.38
  pour Bottom (isolate 0.381): 19.68,127.89 37.21,127.89 37.21,92.84 33.15,88.77 33.15,83.18 36.7,79.63 36.7,76.83 36.45,76.58 22.48,76.58 22.48,116.46 19.56,119.38
IO0
  Top 0.254: UM2.IOL0 UM1.IO0
IO1
  Top 0.254: UM2.IOL1 UM1.IO1
IO2
  Top 0.254: UM2.IOL2 UM1.IO2
IO11
  Top 0.254: UM2.IOH11 UM1.IO11
IO12
  Top 0.203: STATUS.1 60.33,105.02 60.96,104.39 60.96,101.47 UM2.IOH12
  Top 0.254: UM2.IOH12 UM1.IO12
IO13  (via drill 0.6)
  Top 0.203: STATUS.3 59.65,103.29 v60.07,103
  Top 0.254: UM1.IO13 UM2.IOH13
  Bottom 0.203: v60.07,103 UM2.IOH13
MISO  (via drill 0.6)
  Top 0.203: v32,30.48 31.75,30.73 31.75,35.18 UM1.31
  Bottom 0.203: ICSP.1 v32,30.48
MOSI
  Bottom 0.203: ICSP.4 14.48,31.75 16.38,31.75 17.14,30.99 28.19,30.99 30.48,33.27 UM1.32
MRX1  (via drill 0.6)
  Top 0.203: SERIAL_1.3 43.18,13.46 47.24,17.53 47.24,26.04 44.45,28.83 44.45,38.48 45.85,39.88 v45.85,49.15
  Bottom 0.203: v45.85,49.15 JP1.3
  Bottom 0.254: UM1.IO19 JP1.3
MRX2  (via drill 0.6)
  Top 0.203: v50.8,54.23 51.18,53.85 51.18,41.78 52.07,40.77 52.07,14.86 55.88,11.05 SERIAL_2.3
  Bottom 0.203: JP1.5 v50.8,54.23
  Bottom 0.254: UM1.IO17 JP1.5
MRX3  (via drill 0.6)
  Top 0.203: v55.88,59.31 55.88,41.53 57.15,40.26 v57.15,16.51 | v67.44,13.97 67.44,13.08 68.96,11.18 68.96,9.65 SERIAL_3.3
  Bottom 0.203: v57.15,16.51 57.91,15.75 65.66,15.75 v67.44,13.97
  Bottom 0.254: UM1.IO15 JP1.7 v55.88,59.31
MTX1  (via drill 0.6)
  Top 0.203: SERIAL_1.4 45.72,15.11 47.75,17.14 47.75,26.8 46.99,27.56 46.99,39.12 47.75,39.88 v47.75,51.56
  Bottom 0.203: JP1.4 57.15,51.56 v47.75,51.56
  Bottom 0.254: JP1.4 UM1.IO18
MTX2  (via drill 0.6)
  Top 0.203: v53.59,56.77 53.59,41.4 54.61,40.39 54.61,15.37 58.42,11.56 SERIAL_2.4
  Bottom 0.254: UM1.IO16 JP1.6 v53.59,56.77
MTX3  (via drill 0.6)
  Top 0.203: v68.83,13.97 68.83,12.45 71.12,10.16 SERIAL_3.4 | v57.78,61.85 57.78,39.75 59.69,37.85 59.69,27.18 60.33,26.54 v60.33,16.89
  Bottom 0.203: v68.83,13.97 66.55,17.14 61.09,17.14 v60.33,16.89
  Bottom 0.254: UM1.IO14 JP1.8 v57.78,61.85
N$1
  Bottom 0.406: STP1.5 P1.1
N$2
  Top 0.203: STATUS.2 59.69,106.51 R12.2
N$3
  Top 0.254: R11.2 81.84,122.55 PWR.A
N$4  (via drill 0.6)
  Top 0.254: R1.1 46.35,105.93 46.35,98.42 44.45,96.52 STP1.3 | v46.99,84.2 47.5,84.71 SIG_ISO1.3
  Bottom 0.254: STP1.3 44.45,93.85 46.23,92.07 46.23,86.87 45.59,86.23 45.59,84.71 46.1,84.2 v46.99,84.2
N$5  (via drill 0.6)
  Top 0.203: v56.01,93.34 56.92,92.43 SW2.1 SW2.3
  Top 0.254: R2.1 47.36,98.16 46.99,97.79 STP1.2 | v46.99,85.85 47.12,85.98 SIG_ISO1.2
  Bottom 0.203: STP1.2 49.15,93.34 v56.01,93.34
  Bottom 0.254: STP1.2 v46.99,85.85
N$6  (via drill 0.6)
  Top 0.203: SW2.2 SW2.4 59.53,95.92 arc90 58.55,96.9 v56.01,96.9
  Bottom 0.203: v56.01,96.9 54.36,98.55 54.36,117.73 arc97 52.2,119.63 46.35,119.63 arc90 P1.2
  Bottom 0.406: STP1.6 P1.2
N$7
  Bottom 0.406: STP2.5 P2.1
N$8
  Top 0.203: R13.2 56.77,105.46 56.77,104.9 56.89,104.53 STATUS.4
N$9  (via drill 0.6)
  Top 0.254: STP2.3 26.67,96.65 28.57,98.55 28.57,105.93 R3.1 | v29.21,84.07 29.84,84.71 SIG_ISO2.3
  Bottom 0.254: STP2.3 26.67,94.61 28.57,92.71 28.57,86.99 27.81,86.23 27.81,84.58 28.32,84.07 v29.21,84.07
N$10  (via drill 0.6)
  Top 0.203: SW3.2 SW3.4 arc90 58.04,102.87 arc-93 54.36,106.81 54.36,116.33 56.13,118.11 56.13,127.89 arc90 55.24,128.78 39.12,128.78 arc90 38.1,127.76 v38.1,123.7
  Bottom 0.203: v38.1,123.7 28.83,123.7 arc90 P2.2
  Bottom 0.406: STP2.6 P2.2
N$11
  Top 0.254: C2.1 42.28,86.64 REG1.3
  Top 0.406: REG1.3 41.89,86.18 DCDC1.5
N$12
  Top 0.254: C7.1 24.5,86.64 REG2.3
  Top 0.406: REG2.3 24.11,86.18 DCDC2.5
N$13  (via drill 0.6)
  Top 0.203: SW3.3 SW3.1 55.6,98.02 arc90 54.36,96.77 54.36,93.73 51.05,90.42 v51.05,83.06 | v36.7,77.72 v44.96,77.72
  Top 0.254: R4.1 29.58,98.16 29.21,97.79 STP2.2 | v29.21,85.98 SIG_ISO2.2
  Bottom 0.203: v29.21,85.98 30.99,85.98 36.7,80.14 v36.7,77.72 | v51.05,83.06 45.72,77.72 v44.96,77.72
  Bottom 0.254: STP2.2 v29.21,85.98
N$14
  Top 0.406: 68.33,16.13 69.72,16.13
N$15
  Top 0.406: 64.01,16 65.53,16
N$16
  Top 0.406: 19.81,16.13 21.34,16.13
N$17
  Top 0.406: 13.97,16 15.49,16
N$20
  Top 0.254: UM1.ADH7 JP2.8
N$21
  Top 0.254: UM1.ADH6 JP2.7
N$22
  Top 0.254: UM1.ADH5 JP2.6
N$23
  Top 0.254: UM1.ADH4 JP2.5
N$24
  Top 0.254: UM1.ADH3 JP2.4
N$25
  Top 0.254: UM1.ADH2 JP2.3
N$26
  Top 0.254: UM1.ADH1 JP2.2
N$27
  Top 0.254: UM1.ADH0 JP2.1
NC1
  Top 0.254: UM1.NC1 UM2.PWR_NC
P3V
  Top 0.813: UM1.P3V UM2.PWR_3_3V
RST  (via drill 0.6)
  Top 0.203: v14.35,58.67 12.19,60.83 12.19,95 14.61,97.41 UM2.PWR_RESET
  Top 0.254: UM1.RST UM2.PWR_RESET | SW1.2A SW1.2B 18.38,118.33 18.03,117.98 18.03,114.71 18.39,114.35 18.38,106.9 v18.92,106.17
  Bottom 0.203: ICSP.5 13.72,37.97 13.08,38.61 13.08,57.79 13.97,58.67 v14.35,58.67
  Bottom 0.254: v18.92,106.17 18.92,98.81 UM1.RST
SCK
  Bottom 0.203: ICSP.3 17.4,31.5 25.27,31.5 26.67,32.89 26.67,35.05 UM1.33
SCL  (via drill 0.6)
  Top 0.203: v81.53,20.7 77.47,17.4 73.79,17.4 72.64,18.54 v71.37,18.54 SJ1.1 | SJ4.1 v18.29,18.54
  Top 0.254: UM1.SCL UM2.IOH17 R9.2
  Bottom 0.203: v81.53,20.7 82.42,21.46 82.42,111.89 80.01,114.3 78.74,114.3 | v18.29,18.54 v71.37,18.54
  Bottom 0.254: UM1.SCL 71.25,114.3 78.74,114.3
SCL1  (via drill 0.6)
  Top 0.203: SJ1.3 68.33,22.86 67.31,23.88 67.31,36.58 65.95,41.62 R7.1 | 58.04,72.52 v55.88,75.18 | v36.07,44.07 36.07,38.35 36.83,37.59 36.83,32.51 36.07,31.75 v36.07,16
  Top 0.254: 68.33,15.75 SJ1.3 | R5.1 57.78,81.9 57.78,83.44 56.52,84.71 v55.88,84.71 SIG_ISO1.6 | SIG_ISO2.6 v38.73,84.71 | 58.04,72.52 59.31,71.25 v59.31,44.07 | R7.1 64.9,42.67 JP1.1 | SJ4.3 v23.88,16
  Bottom 0.203: v59.31,44.07 v36.07,44.07 | v36.07,16 v23.88,16
  Bottom 0.254: v38.73,84.71 38.73,83.31 40.01,82.04 40.01,73.41 40.77,72.64 54.74,72.64 55.88,73.79 v55.88,75.18 v55.88,84.71 | UM1.IO21 JP1.1 v59.31,44.07
SCLA  (via drill 0.6)
  Top 0.203: v19.43,11.81 19.81,12.45 SJ4.2 19.81,21.59 20.32,22.1 I2C_3.4
  Bottom 0.203: I2C_2.4 31.75,11.18 20.32,11.18 | I2C_1.4 20.32,11.18 | 20.32,11.18 v19.43,11.81
  Bottom 0.254: I2C_3.4 21.59,27.69 31.75,27.69 I2C_4.4
SCLB  (via drill 0.6)
  Top 0.203: I2C_6.4 v59.05,20.07 | I2C_5.4 v45.97,20.07
  Top 0.254: SJ1.2 69.85,18.92 v71.12,20.19 I2C_7.4
  Bottom 0.203: v71.12,20.19 70.23,20.07 v59.05,20.07 v45.97,20.07
SDA  (via drill 0.6)
  Top 0.203: v79.5,14.86 74.8,14.86 71.88,12.95 v71.12,12.95
  Top 0.254: UM1.SDA UM2.IOH16 R10.2 | SJ3.1 v12.45,12.83 | SJ2.1 v62.48,13.97 v62.48,11.43
  Bottom 0.203: 81.79,111.38 79.76,113.41 73.79,113.41
  Bottom 0.254: UM1.SDA 70.48,111.25 73.79,113.41 | 81.79,111.38 81.79,23.37 79.5,21.21 v79.5,14.86 | v71.12,12.95 66.93,12.95 66.04,13.84 62.61,13.84 v62.48,13.97 | v62.48,11.43 61.34,11.43 59.69,12.83 v12.45,12.83
SDA1  (via drill 0.6)
  Top 0.203: SJ2.3 65.53,22.73 64.77,23.5 64.77,29.21 62.23,32.26 62.23,37.21 60.83,38.35 60.83,40.51 61.94,41.62 R8.1
  Top 0.254: SJ3.3 v15.49,14.1 | v65.15,12.83 SJ2.3 | SIG_ISO1.7 54.36,85.85 57.4,85.85 59.05,84.2 59.05,79.76 v58.23,78.93 57.66,78.36 R6.1 | SIG_ISO2.7 38.23,85.98 v38.73,86.49 | v60.33,46.61 60.33,73.53 v58.42,75.44 | R8.1 60.96,43.14 60.96,44.45 63.12,46.61 JP1.2
  Bottom 0.203: v59.82,14.1 v15.49,14.1
  Bottom 0.254: v59.82,14.1 61.09,12.83 v65.15,12.83 | v38.73,86.49 38.1,86.49 36.96,85.34 36.96,84.07 39.37,81.66 39.37,72.9 40.26,72.01 54.99,72.01 v58.42,75.44 58.42,78.74 v58.23,78.93 | UM1.IO20 JP1.2 v60.33,46.61
SDAA
  Top 0.203: I2C_1.3 17.78,10.54 | 17.78,10.54 29.21,10.54 I2C_2.3 | 17.78,10.54 13.97,10.54 SJ3.2
  Top 0.254: I2C_4.3 29.21,26.92 19.05,26.92 I2C_3.3 13.97,21.34 SJ3.2
SDAB  (via drill 0.6)
  Top 0.203: 64.01,18.41 64.01,20.7 61.85,22.86 v61.85,29.21 | v68.58,29.21 I2C_7.3
  Top 0.254: 64.01,18.41 SJ2.2
  Bottom 0.203: v68.58,29.21 v61.85,29.21 59.31,29.21 I2C_6.3 53.34,27.56 45.72,27.56 I2C_5.3
V_ISO1
  Top 0.254: C1.1 R1.2 R2.2 | C1.1 STP1.4 | C1.1 46.48,109.47 45.72,108.71 45.72,98.81 43.05,96.14 43.05,94.23 44.08,93.21 C3.2 44.82,91.69 C4.2 45.32,88.38 REG1.1 46.22,86.61 46.86,87.25 SIG_ISO1.1
V_ISO2
  Top 0.254: C6.1 R3.2 R4.2 | C6.1 STP2.4 | C6.1 28.57,109.47 27.94,108.84 27.94,98.93 25.02,96.01 25.02,94.49 26.3,93.21 C8.2 27.04,91.69 C9.2 27.54,88.38 REG2.1 28.44,86.61 29.08,87.25 SIG_ISO2.1
VCOM  (via drill 0.6)
  Top 0.254: UM1.IRF UM2.PWR_IOREF | SIG_ISO1.8 55.63,87.25 56.77,88.39 | 56.77,88.39 56.77,89.78 C5.2 | SIG_ISO2.8 37.21,87.25 v38.16,88.2 39,89.04 C10.2 | 54.86,77.09 54.98,77.2 R6.2 R5.2 | v54.36,70.1 54.74,70.48 54.74,76.96 54.86,77.09 | 56.77,88.39 57.4,88.39 59.69,86.11 59.69,78.36 58.42,77.09 54.86,77.09
  Bottom 0.254: v54.36,70.1 53.34,71.12 40.39,71.12 38.73,72.77 | 38.73,72.77 38.73,81.03 36.32,83.44 36.32,86.36 v38.16,88.2 | 38.73,72.77 33.27,72.77 32.51,72.01 32.51,69.09 31.11,67.69 23.11,67.69 21.97,68.83 21.97,98.3 UM1.IRF
VIN
  Top 0.254: UM2.PWR_VIN UM1.VIN

### Text on the board
Dimension: 2-sided PC board | 0.062"-Thick material | 1/2-Ounce copper | Blue solder mask | Exclude solder mask from vias | Exclude silkscreen from pads | Omit any lettering too small to / clearly render on silkscreen layers
tPlace: +5V | RESET | GND | GND | +5V | k | STP3 | OpenAg / Signal PCB v1.1 | VCC | VCC | PGND | PRB | PGND | PRB | STP4 | GND | D10 | +5V | A0 | +5V | UM1a | GND | UM1f | RX | TX | RX | TX | 2 | 1 | 1 | GND | GND | GND | 1 | +5V | D9 | A1 | +5V | GND | GND | D8 | +5V | A2 | +5V | UM1b | UM1d | GND | GND | D7 | +5V | A3 | +5V | GND | GND | +5V | D6 | A4 | +5V | UM1c | GND | UM1e | GND | +5V | D5 | A5 | +5V | GND | RST | GND | MAN1 | SCK | MOSI | MISO | D4 | +5V | A6 | GND | +5V | SD | CK | GND | +5V | SD | CK | GND | +5V | SD | CK | GND | +5V | SD | CK | GND | +5V | SD | CK | +5 | GND | GND | +5V | D3 | A7 | +5V | GND | GND | +5V | SD | CK | GND | +5V | SD | CK | GND | +5V | RX | TX | GND | +5V | RX | TX | G | +5V | RX | TX
bPlace: UM2xa | UM2Xb | JP1 | UM2Xd | Mega | UM2Xc | JP2